# Altium schematic sheet [SCH]_HMI.SchDoc: MOTHERBOARD
size 297 x 209 mm; CheckedBy: THIEN-KEMC; CompanyName: TEAM GA MO; DrawnBy: Vo Hao Hao; Organization: TEAM GA MO; Address1: TEAM GA MO Limited; Address2: 30, Nhat Hamet, Thanh Hoa, Phung Hiep, HG; TGM_Number: TGA-00005-04-1; Projet: EGG INCUBATION (PC-BASED MEASUREMENT AND CONTROL SYSTEMS); ModifiedBy: -; CreateDate: XX/XX/XXXX; CheckedDate: -; Title2: INPUT/OUTPUT; DivGrp: TGM; Designer: Vo Hao Hao
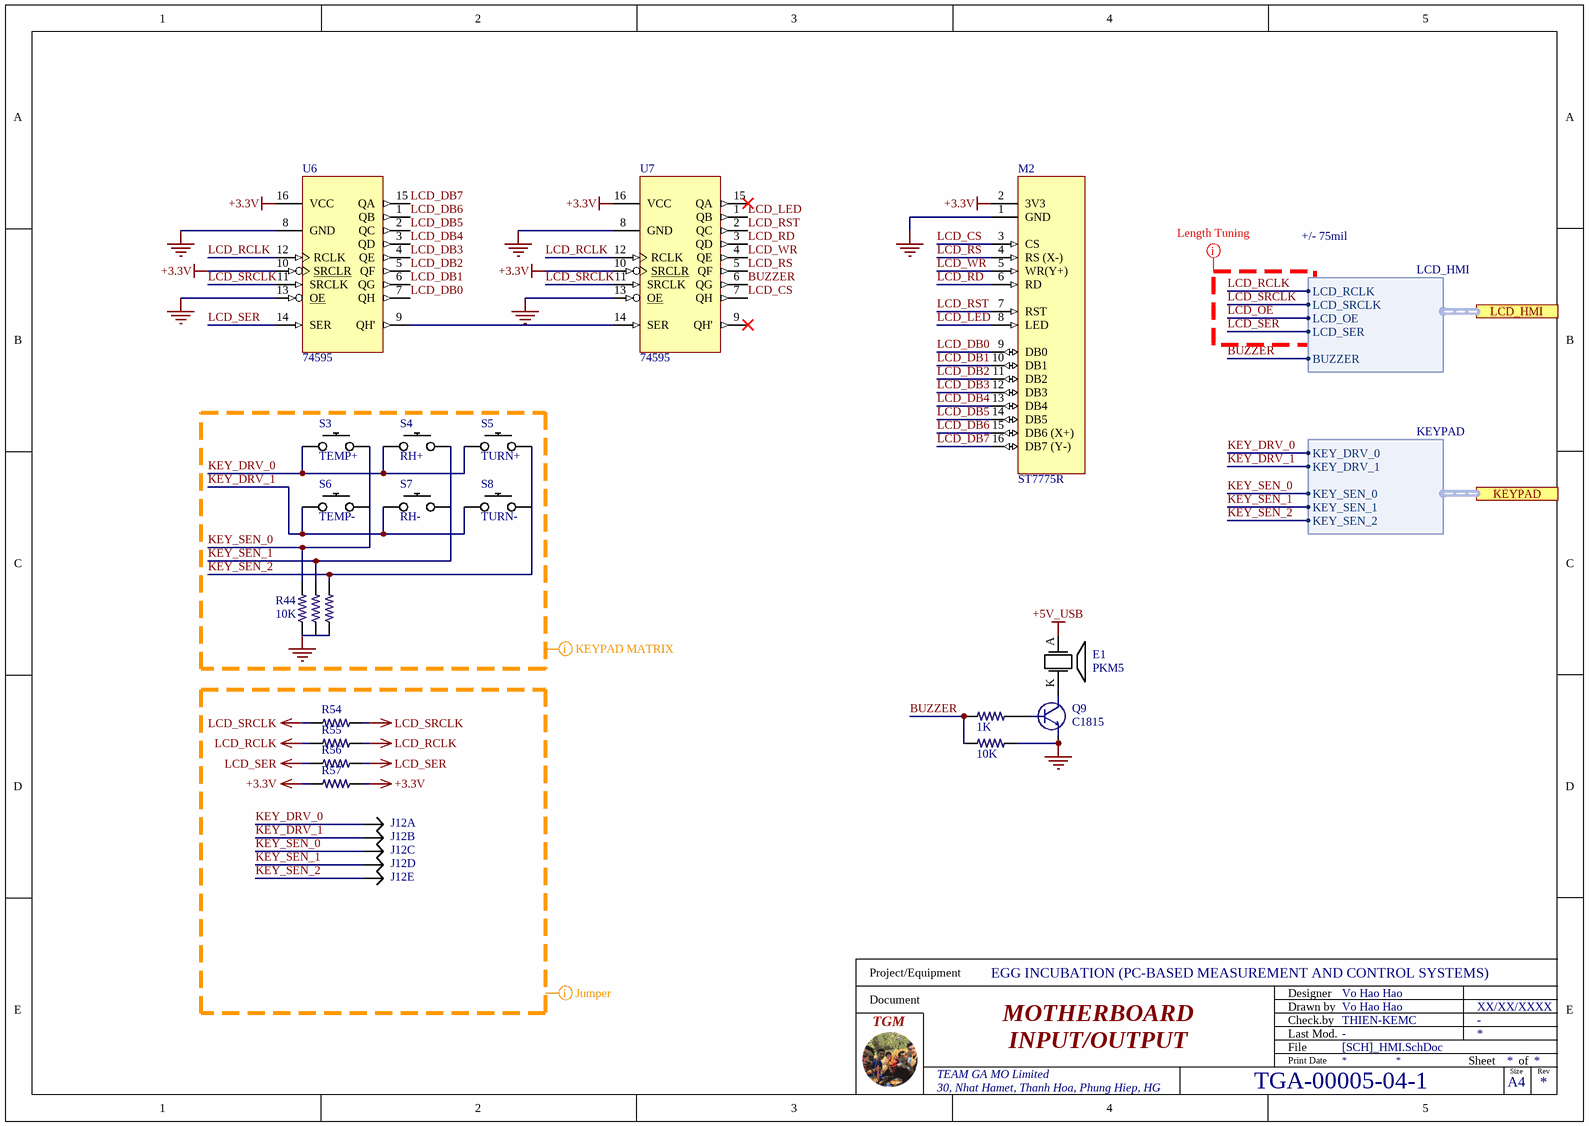
[diagram p0: [SCH]_HMI.SchDoc]

## Parts
E1  PKM5  [BUZZER]
J12  KEYPAD  [Header 5P]  (value not drawn)  (parts A,B,C,D,E of 5)
M2  ST7775R  [LCD_176X220_MODULE]
Q9  C1815  [SOT23(123)]
R44  value 10K  [RES-SMD-0805]  (hidden comment: RES-2512-4.7R)  (graphical)
R45  RES-2512-4.7R  [RES-SMD-0805]  (value not drawn)  (graphical)
R46  RES-2512-4.7R  [RES-SMD-0805]  (value not drawn)  (graphical)
R47  value 1K  [RES-SMD-0805]  (hidden comment: RES-2512-4.7R)
R48  value 10K  [RES-SMD-0805]  (hidden comment: RES-2512-4.7R)
R54  R0805  [RES-SMD-0805]  (value not drawn)
R55  R0805  [RES-SMD-0805]  (value not drawn)
R56  R0805  [RES-SMD-0805]  (value not drawn)
R57  R0805  [RES-SMD-0805]  (value not drawn)
S3  TEMP+  [Header 2P]  (graphical)
S4  RH+  [Header 2P]  (graphical)
S5  TURN+  [Header 2P]  (graphical)
S6  TEMP-  [Header 2P]  (graphical)
S7  RH-  [Header 2P]  (graphical)
S8  TURN-  [Header 2P]  (graphical)
U6  74595  [SOIC-16S]
U7  74595  [SOIC-16S]

## Ports
KEYPAD (harness KEYPAD), LCD_HMI (harness LCD_HMI)

## Harnesses
LCD_HMI: LCD_RCLK, LCD_SRCLK, LCD_OE, LCD_SER, BUZZER
KEYPAD: KEY_SEN_0, KEY_SEN_1, KEY_SEN_2, KEY_DRV_0, KEY_DRV_1

## Nets
+3.3V: M2.2(3V3) R57.1 R57.2 U6.10(SRCLR) U6.16(VCC) U7.10(SRCLR) U7.16(VCC)
+5V_USB: E1.A
GND: M2.1(GND) Q9.3(E) R44.2 R45.2 R46.2 R48.2 U6.8(GND) U6.13(OE) U7.8(GND) U7.13(OE)
LCD_RCLK: R55.1 R55.2 U6.12(RCLK) U7.12(RCLK) ; port LCD_HMI.LCD_RCLK
LCD_SER: R56.1 R56.2 U6.14(SER) ; port LCD_HMI.LCD_SER
LCD_SRCLK: R54.1 R54.2 U6.11(SRCLK) U7.11(SRCLK) ; port LCD_HMI.LCD_SRCLK
BUZZER: R47.1 R48.1 U7.6(QG) ; port LCD_HMI.BUZZER
KEY_DRV_0: J12.1 S3.1 S4.1 S5.1 ; port KEYPAD.KEY_DRV_0
KEY_DRV_1: J12.2 S6.1 S7.1 S8.1 ; port KEYPAD.KEY_DRV_1
KEY_SEN_0: J12.3 R44.1 S3.1 S6.1 ; port KEYPAD.KEY_SEN_0
KEY_SEN_1: J12.4 R45.1 S4.1 S7.1 ; port KEYPAD.KEY_SEN_1
KEY_SEN_2: J12.5 R46.1 S5.1 S8.1 ; port KEYPAD.KEY_SEN_2
LCD_CS: M2.3(CS) U7.7(QH)
LCD_DB0: M2.9(DB0) U6.7(QH)
LCD_DB1: M2.10(DB1) U6.6(QG)
LCD_DB2: M2.11(DB2) U6.5(QF)
LCD_DB3: M2.12(DB3) U6.4(QE)
LCD_DB4: M2.13(DB4) U6.3(QD)
LCD_DB5: M2.14(DB5) U6.2(QC)
LCD_DB6: M2.15(DB6_(X+)) U6.1(QB)
LCD_DB7: M2.16(DB7_(Y-)) U6.15(QA)
LCD_LED: M2.8(LED) U7.1(QB)
LCD_OE: port LCD_HMI.LCD_OE
LCD_RD: M2.6(RD) U7.3(QD)
LCD_RS: M2.4(RS_(X-)) U7.5(QF)
LCD_RST: M2.7(RST) U7.2(QC)
LCD_WR: M2.5(WR(Y+)) U7.4(QE)
NetE1_K: E1.K Q9.2(C)
NetQ9_1: Q9.1(B) R47.2
NetU6_9: U6.9(QH') U7.14(SER)

Not connected (* = marked no-connect by the designer): U7 9(QH')* 15(QA)*

## Layout directives
net class ADC_DATA - 150mil: LCD_OE, LCD_RCLK, LCD_SER, LCD_SRCLK
mark named KEYPAD MATRIX: GND, KEY_DRV_0, KEY_DRV_1, KEY_SEN_0, KEY_SEN_1, KEY_SEN_2
mark named Jumper: +3.3V, KEY_DRV_0, KEY_DRV_1, KEY_SEN_0, KEY_SEN_1, KEY_SEN_2, LCD_RCLK, LCD_SER, LCD_SRCLK

## Notes on the sheet
- +/- 75mil
- Project/Equipment
- Document
- Designer
- Drawn by
- Check.by
- File
- Last Mod.
- Print Date
- Sheet
- Size
- A4
- of
- Rev

## Library data of the parts
E1 = BUZZER: ALARM-AUDIBLE PIEZO ALARM PIN TYPE; 5V
J12 = JP5
M2 = LCD_176x220: ComponentLink1Description: Wiki; ComponentLink1URL: http://www.lcdwiki.com/2.8inch_SPI_Module_ILI9341_SKU:MSP2807
Q9 = NPN: Transistor, NPN, RF, 50mA, 12V; Supplier 1: Digi-Key; Supplier Part Number 1: 568-11514-1-ND
R44 R47 R48 = RES: Chip Resistor, 0805, 1%, 1/8 W; PackageReference: J1-0805; PackageDescription: Chip Resistor; Supplier Part Number 1: 311-1.00KLRCT-ND; Price: 0.005
R45 R46 = RES: Chip Resistor, 0805, 1%, 1/8 W; Value: 10K; PackageReference: J1-0805; PackageDescription: Chip Resistor; Supplier Part Number 1: 311-1.00KLRCT-ND; Price: 0.005
R54-R57 = RES: Chip Resistor, 0805, 1%, 1/8 W; Value: 0; Supplier Part Number 1: 311-1.00KLRCT-ND; PackageReference: J1-0805; PackageDescription: Chip Resistor; Price: 0.005
S3-S8 = SWITCH TACTILE SPST: SWITCH TACTILE SPST-NO 0.05A 12V; Manufacturer Part Number: TL3342F260QG; Supplier 1: Digi-Key; Supplier Part Number 1: EG5470CT-ND
U6 U7 = 74595: CD74HC595 8-Bit Shift Registers With 3-State Output Registers